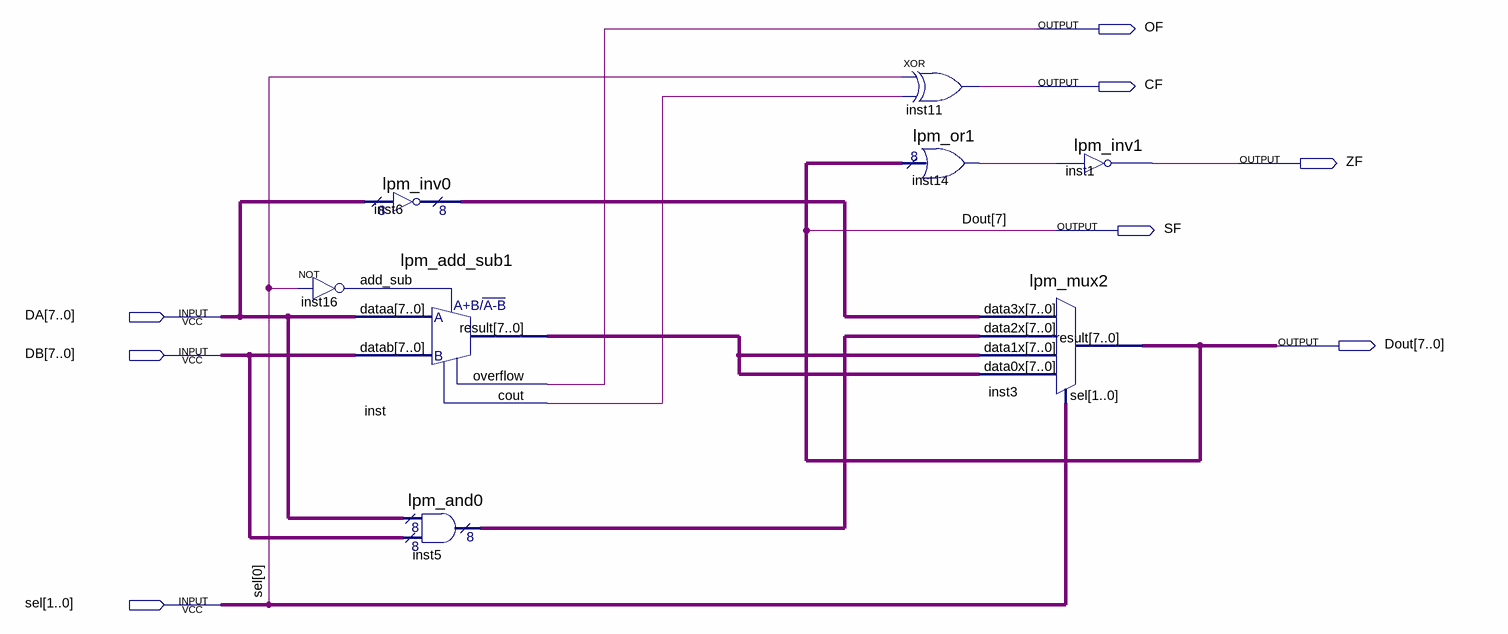
[diagram p0: schematic sheet]
// Quartus schematic ALU.bdf as structural Verilog: 8 symbols, 8 pins
module ALU (
  input  [7:0] DA,
  input  [7:0] DB,
  input  [1:0] sel,
  output OF,
  output CF,
  output ZF,
  output SF,
  output [7:0] Dout
);

  wire inst14_result, inst16_out, inst_cout;
  wire [7:0] inst5_result, inst6_result, inst_result;

  not inst16 (inst16_out, sel[0]);
  lpm_inv0 inst6 (.data(DA), .result(inst6_result));
  lpm_add_sub1 inst (
    .dataa(DA), .datab(DB), .add_sub(inst16_out), .result(inst_result), .overflow(OF), .cout(inst_cout));
  lpm_and0 inst5 (.data0x(DA), .data1x(DB), .result(inst5_result));
  xor inst11 (CF, sel[0], inst_cout);
  lpm_or1 inst14 (.data(Dout), .result(inst14_result));
  lpm_mux2 inst3 (
    .data3x(inst6_result), .data2x(inst5_result), .data1x(inst_result), .data0x(inst_result), .sel(sel),
    .result(Dout));
  lpm_inv1 inst1 (.data(inst14_result), .result(ZF));

  assign SF = Dout[7];
endmodule
